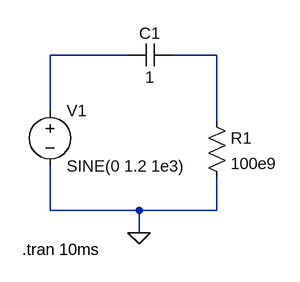
[diagram p0: schematic Draft1.asc]
Draft1.asc, the LTspice schematic file:
Version 4
SHEET 1 880 680
WIRE 160 -32 48 -32
WIRE 288 -32 224 -32
WIRE 48 48 48 -32
WIRE 288 64 288 -32
WIRE 48 192 48 128
WIRE 176 192 48 192
WIRE 288 192 288 144
WIRE 288 192 176 192
WIRE 176 224 176 192
FLAG 176 224 0
SYMBOL voltage 48 32 R0
WINDOW 123 0 0 Left 0
WINDOW 39 0 0 Left 0
SYMATTR InstName V1
SYMATTR Value SINE(0 1.2 1e3)
SYMBOL cap 224 -48 R90
WINDOW 0 0 32 VBottom 2
WINDOW 3 32 32 VTop 2
SYMATTR InstName C1
SYMATTR Value 1
SYMBOL res 272 48 R0
SYMATTR InstName R1
SYMATTR Value 100e9
TEXT 8 248 Left 2 !.tran 10ms

The netlist it stands for:
* Draft1.asc
V1 N001 0 SINE(0 1.2 1e3)
C1 N002 N001 1
R1 N002 0 100e9
.tran 10ms
.backanno
.end